# Altium schematic sheet Mechatronic.SchDoc
size A; SheetNumber: 1; SheetTotal: 1
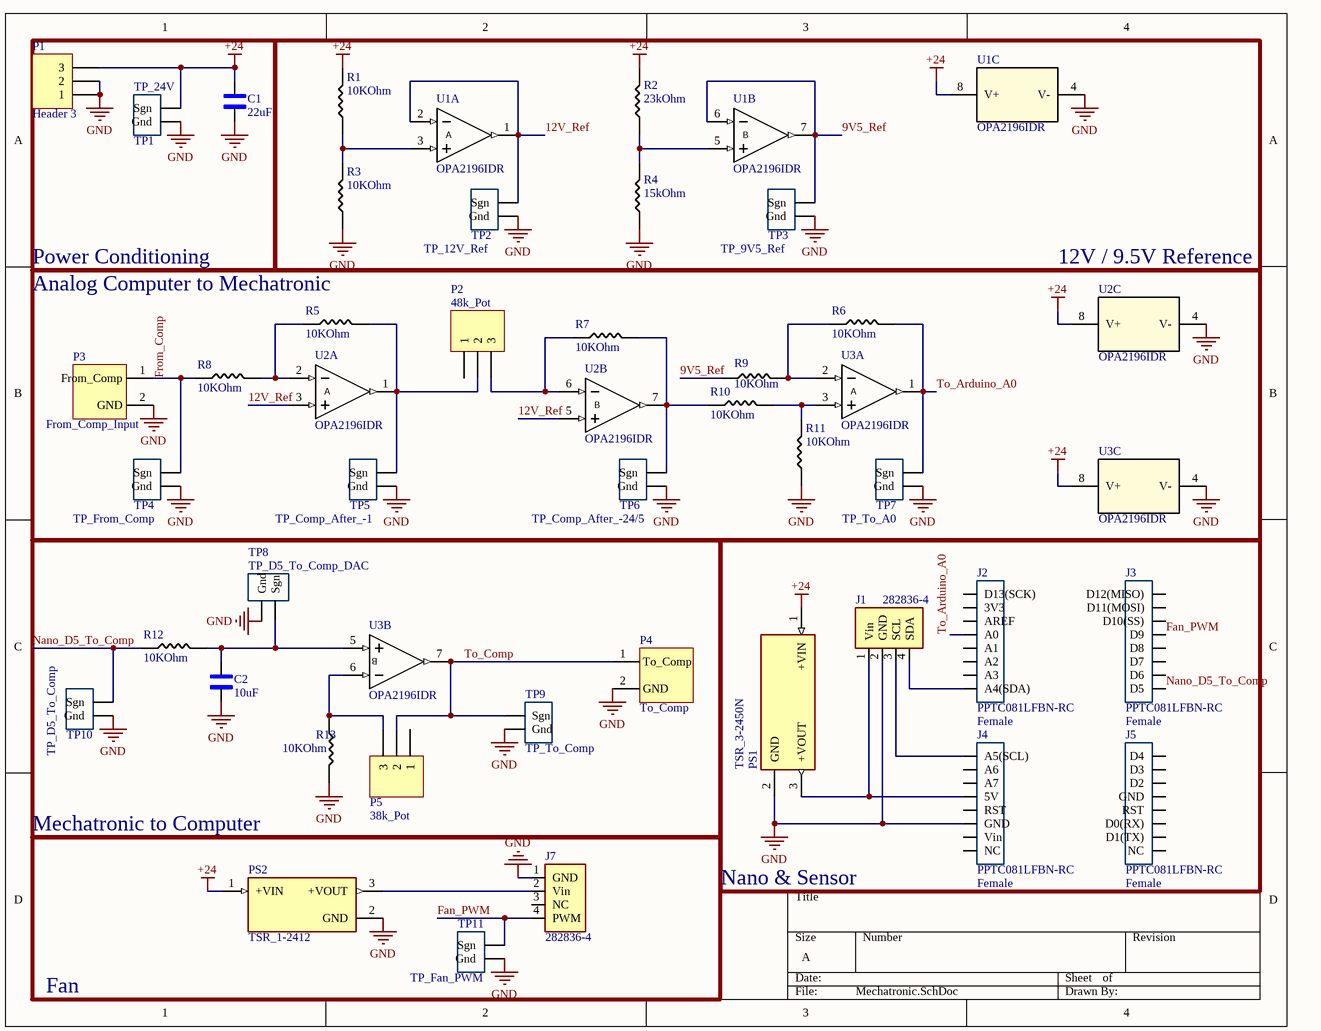
[diagram p0: Mechatronic.SchDoc]

## Parts
C1  22uF  [1206_Passive_Capacitor]
C2  10uF  [1206_Passive_Capacitor]
J1  282836-4  [TE_282836-4]
J2  PPTC081LFBN-RC  value Female  [8_PIN_100MIL - Female]
J3  PPTC081LFBN-RC  value Female  [8_PIN_100MIL - Female]
J4  PPTC081LFBN-RC  value Female  [8_PIN_100MIL - Female]
J5  PPTC081LFBN-RC  value Female  [8_PIN_100MIL - Female]
J7  282836-4  [TE_282836-4]
P1  Header 3  [HDR1X3]
P2  48k_Pot  [HDR1X3]
P3  From_Comp_Input  [P_Terminal block 3.5mm-pitch]
P4  To_Comp  [P_Terminal block 3.5mm-pitch]
P5  38k_Pot  [HDR1X3]
PS1  TSR_3-2450N  [CONV_TSR_3-2450N]
PS2  TSR_1-2412  [CONV_TSR_1-2412]
R1  value 10KOhm  [1206_Passive_Resitor]  (hidden comment: 10k)
R2  value 23kOhm  [1206_Passive_Resitor]  (hidden comment: 0 Ohm)
R3  value 10KOhm  [1206_Passive_Resitor]  (hidden comment: 10k)
R4  value 15kOhm  [1206_Passive_Resitor]  (hidden comment: 0 Ohm)
R5  value 10KOhm  [1206_Passive_Resitor]  (hidden comment: 10k)
R6  value 10KOhm  [1206_Passive_Resitor]  (hidden comment: 10k)
R7  value 10KOhm  [1206_Passive_Resitor]  (hidden comment: 10k)
R8  value 10KOhm  [1206_Passive_Resitor]  (hidden comment: 10k)
R9  value 10KOhm  [1206_Passive_Resitor]  (hidden comment: 10k)
R10  value 10KOhm  [1206_Passive_Resitor]  (hidden comment: 10k)
R11  value 10KOhm  [1206_Passive_Resitor]  (hidden comment: 10k)
R12  value 10KOhm  [1206_Passive_Resitor]  (hidden comment: 10k)
R13  value 10KOhm  [1206_Passive_Resitor]  (hidden comment: 10k)
TP1  TP_24V  [TP10x_Probe]
TP2  TP_12V_Ref  [TP10x_Probe]
TP3  TP_9V5_Ref  [TP10x_Probe]
TP4  TP_From_Comp  [TP10x_Probe]
TP5  TP_Comp_After_-1  [TP10x_Probe]
TP6  TP_Comp_After_-24/5  [TP10x_Probe]
TP7  TP_To_A0  [TP10x_Probe]
TP8  TP_D5_To_Comp_DAC  [TP10x_Probe]
TP9  TP_To_Comp  [TP10x_Probe]
TP10  TP_D5_To_Comp  [TP10x_Probe]
TP11  TP_Fan_PWM  [TP10x_Probe]
U1  OPA2196IDR  [D0008A_N]  (parts A,B,C of 3)
U2  OPA2196IDR  [D0008A_N]  (parts A,B,C of 3)
U3  OPA2196IDR  [D0008A_N]  (parts A,B,C of 3)

## Blocks framed on the sheet
Power Conditioning: C1 P1 TP1
12V / 9.5V Reference: R1-R4 TP2 TP3 U1
Analog Computer to Mechatronic: P2 P3 R5-R11 TP4-TP7 U2 U3
Mechatronic to Computer: C2 P4 P5 R12 R13 TP8-TP10 U3
Nano & Sensor: J1-J5 PS1

## Nets
+24: C1.2 P1.3 PS1.1(+VIN) PS2.1(+VIN) R1.2 R2.2 TP1.1(Sgn) U1.8(V+) U2.8(V+) U3.8(V+)
GND: C1.1 C2.1 J1.2(GND) J4.6(GND) J7.1(GND) P1.1 P1.2 P3.2(GND) P4.2(GND) PS1.2(GND) PS2.2(GND) R3.1 R4.1 R11.1 R13.2 TP1.2(Gnd) TP2.2(Gnd) TP3.2(Gnd) TP4.2(Gnd) TP5.2(Gnd) TP6.2(Gnd) TP7.2(Gnd) TP8.2(Gnd) TP9.2(Gnd) TP10.2(Gnd) TP11.2(Gnd) U1.4(V-) U2.4(V-) U3.4(V-)
9V5_Ref: R9.1 TP3.1(Sgn) U1.6(IN-) U1.7(OUT)
12V_Ref: TP2.1(Sgn) U1.1(OUT) U1.2(IN-) U2.3(IN+) U2.5(IN+)
Fan_PWM: J3.5(D9) J7.4(PWM) TP11.1(Sgn)
From_Comp: P3.1(From_Comp) R8.1 TP4.1(Sgn)
Nano_D5_To_Comp: J3.1(D5) R12.1 TP10.1(Sgn)
To_Arduino_A0: J2.5(A0) R6.2 TP7.1(Sgn) U3.1(OUT)
To_Comp: P4.1(To_Comp) P5.2 TP9.1(Sgn) U3.7(OUT)
NetC2_2: C2.2 R12.2 TP8.1(Sgn) U3.5(IN+)
NetJ1_1: J1.1(Vin) J4.4(5V) PS1.3(+VOUT)
NetJ1_3: J1.3(SCL) J4.1(A5(SCL))
NetJ1_4: J1.4(SDA) J2.1(A4(SDA))
NetJ7_2: J7.2(Vin) PS2.3(+VOUT)
NetP2_2: P2.2 R5.2 TP5.1(Sgn) U2.1(OUT)
NetP2_3: P2.3 R7.1 U2.6(IN-)
NetP5_3: P5.3 R13.1 U3.6(IN-)
NetR1_1: R1.1 R3.2 U1.3(IN+)
NetR2_1: R2.1 R4.2 U1.5(IN+)
NetR5_1: R5.1 R8.2 U2.2(IN-)
NetR6_1: R6.1 R9.2 U3.2(IN-)
NetR7_2: R7.2 R10.1 TP6.1(Sgn) U2.7(OUT)
NetR10_2: R10.2 R11.2 U3.3(IN+)

Not connected (* = marked no-connect by the designer): J2 2(A3) 3(A2) 4(A1) 6(AREF) 7(3V3) 8(D13(SCK)); J3 2(D6) 3(D7) 4(D8) 6(D10(SS)) 7(D11(MOSI)) 8(D12(MISO)); J4 2(A6) 3(A7) 5(RST) 7(Vin) 8(NC); J5 1(D4) 2(D3) 3(D2) 4(GND) 5(RST) 6(D0(RX)) 7(D1(TX)) 8(NC); J7 3(NC); P2 1; P5 1

## Notes on the sheet
- Fan
- (in symbol OPA2196IDR, part A) A
- (in symbol OPA2196IDR, part B) B

## Library data of the parts
C1 = C_22uF_1206: 22uF ±10% 25V X5R 1206 Multilayer Ceramic Capacitors MLCC - SMD/SMT RoHS; MFR Part #: CL31A226KAHNNNE; Type: basic; LCSC Part#: C12891; Datasheet: https://datasheet.lcsc.com/lcsc/1811031514_Samsung-Electro-Mechanics-CL31A226KAHNNNE_C12891.pdf; Value: 22uF
C2 = C_10uF_1206: 10uF ±10% 50V X5R 1206 Multilayer Ceramic Capacitors MLCC - SMD/SMT RoHS; MFR Part #: CL31A106KBHNNNE; Type: Basic; LCSC Part#: C13585; Datasheet: https://datasheet.lcsc.com/lcsc/1810221112_Samsung-Electro-Mechanics-CL31A106KBHNNNE_C13585.pdf; Value: 10uF
J1 J7 = 282836-4: 4 Position Wire to Board Terminal Block Horizontal with Board 0.197 (5.00mm) Through Hole; MF: TE Connectivity; Package: None; Availability: In Stock; Value: *; MP: 282836-4; Purchase-URL: https://pricing.snapeda.com/search/part/282836-4/?ref=eda; Check_prices: https://www.snapeda.com/parts/282836-4/TE+Connectivity+AMP+Connectors/view-part/?ref=eda; Price: None; SnapEDA_Link: https://www.snapeda.com/parts/282836-4/TE+Connectivity+AMP+Connectors/view-part/?ref=snap
J2-J5 = JF_8_PIN_FEMALE: 8 Position Header Connector 0.100" (2.54mm) Through Hole Tin; Digikey Link: https://www.digikey.com/product-detail/en/PPTC081LFBN-RC/S7006-ND/810147/?itemSeq=304982354; MFR Part #: PPTC081LFBN-RC; Type: Extended; LCSC Part#: C27438
P1 P2 P5 = Header 3: Header, 3-Pin; LatestRevisionDate: 17-Jul-2002; LatestRevisionNote: Re-released for DXP Platform.; Publisher: Altium Limited
P3 P4 = P_Terminal block: Green Straight pin 3.5mm  pitch; P=3.5mm  Screw terminal ROHS; MFR Part #: KF350-3.5-2P; Manufacturer: Cixi Kefa Elec; LCSC Part#: C474892; DataSheet: https://datasheet.lcsc.com/lcsc/2001160007_Cixi-Kefa-Elec-KF350-3-5-2P_C474892.pdf
PS1 = TSR_3-2450N: MF: {'manufacturer': u'Traco Power'}; Package: None; Price: None; Value: *; MP: TSR_3-2450N; Availability: Unavailable
R1 R3 R5-R13 = R_10KOhm_1206: 10 kOhms ±5% 0.25W, 1/4W Chip Resistor 1206 (3216 Metric) Automotive AEC-Q200 Thick Film; MFR Part #: RMCF1206FT10K0; Digikey Link: https://www.digikey.com/en/products/detail/stackpole-electronics-inc/RMCF1206FT10K0/1759669; LCSC Part#: C17902; Type: Basic
R2 R4 = R_0_1206: CHIP RESISTOR - SURFACE MOUNT 0OHMS ±1% 1/4W 1206 ROHS; MFR Part #: 1206W4F0000T5E; Datasheet: https://datasheet.lcsc.com/szlcsc/Uniroyal-Elec-1206W4F0000T5E_C17888.pdf; LCSC Part#: C17888; Type: Basic; Mouser link: https://www.mouser.com/ProductDetail/Royalohm/1206W4F0000T5E?qs=e8oIoAS2J1Thbopin%252BsagQ%3D%3D
TP1-TP11 = TP_10x_Probe: Test Point 300 mil centers
U1-U3 = OPA2196IDR: Dual, 36-V, low power, all-purpose amplifier with mux-friendly input 8-SOIC -40 to 125; Manufacturer_Name: Texas Instruments; TYPE: TYPE; RefDes: RefDes; Copyright: Copyright (C) 2026 Ultra Librarian. All rights reserved.; Manufacturer_Part_Number: OPA2196IDR; Datasheet: https://www.ti.com/lit/gpn/opa2196
PS2 = TSR_1-2412: Price: None; Package: None; Availability: Unavailable; Value: *; MP: TSR_1-2412